# Altium schematic sheet OUTPUT.SchDoc: Titan Yuan
size Letter; DrawnBy: Titan Yuan; SheetNumber: 4; SheetTotal: 5
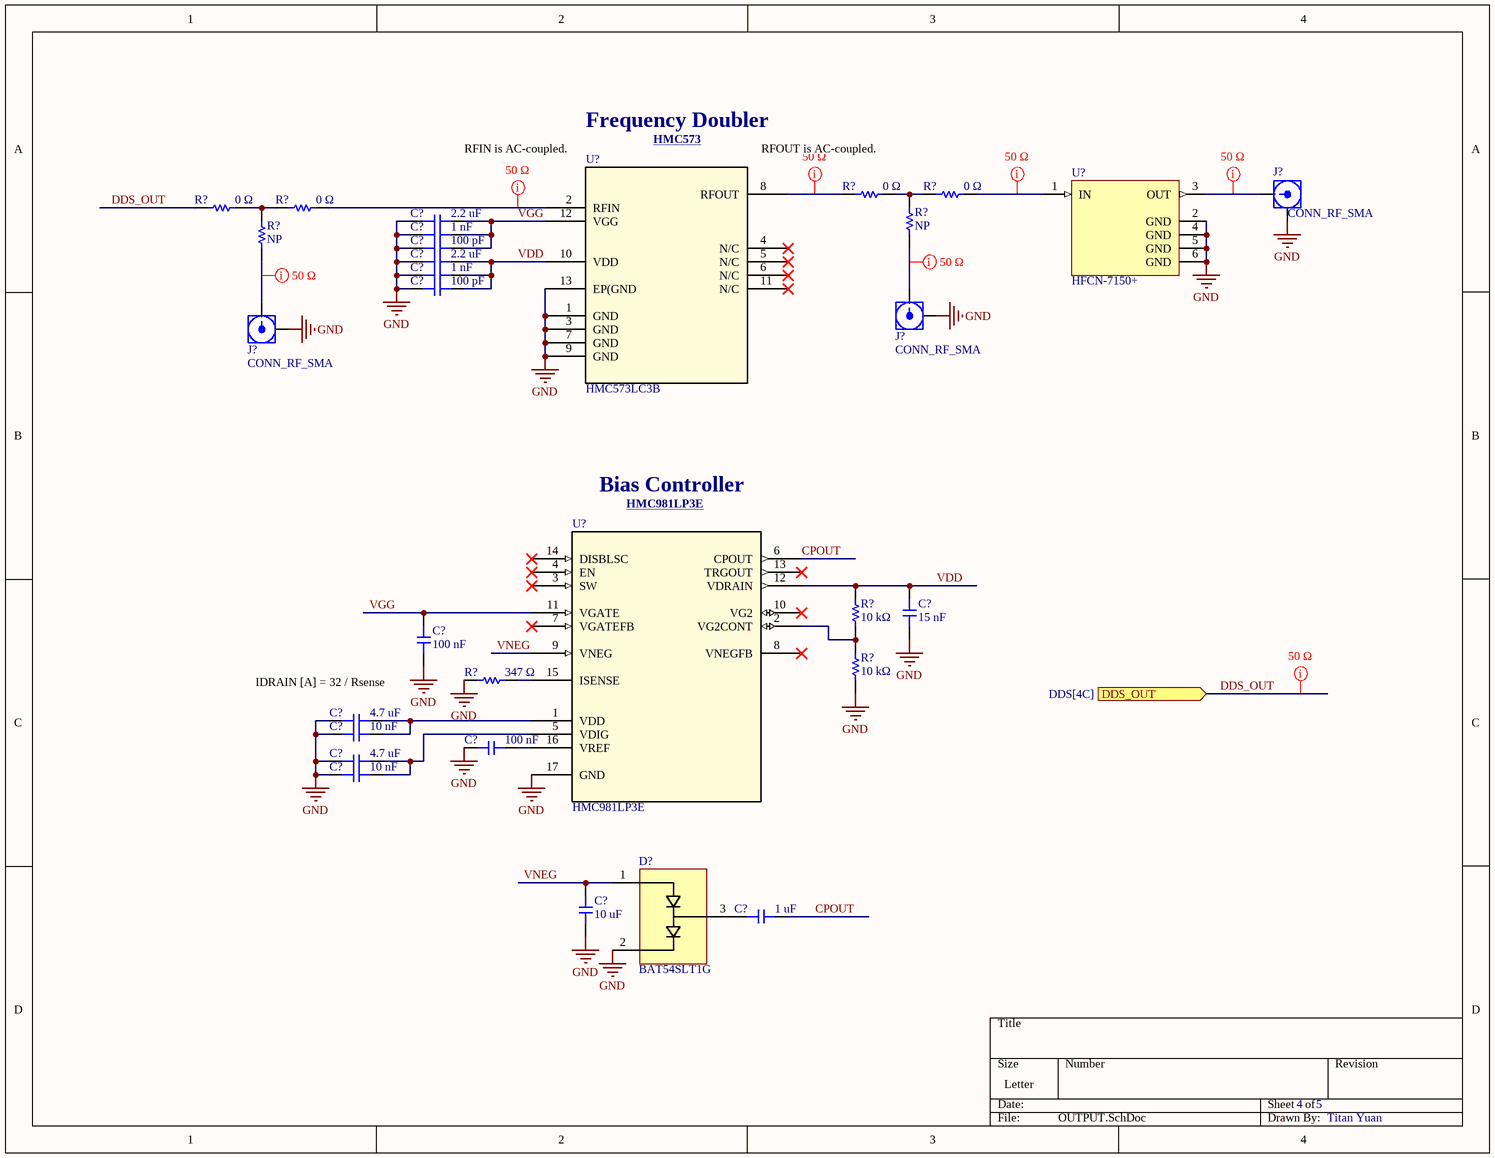
[diagram p0: OUTPUT.SchDoc]

## Parts
(Parts that share a designator on the sheet are numbered #1, #2 ... from top to bottom, then left to right.)
C?#1  2.2 uF  [CAP_0603]
C?#2  1 nF  [CAP_0402]
C?#3  100 pF  [CAP_0402]
C?#4  2.2 uF  [CAP_0603]
C?#5  1 nF  [CAP_0402]
C?#6  100 pF  [CAP_0402]
C?#7  15 nF  [CAP_0402]
C?#8  100 nF
C?#9  4.7 uF  [CAP_0603]
C?#10  10 nF  [CAP_0402]
C?#11  100 nF
C?#12  4.7 uF  [CAP_0603]
C?#13  10 nF  [CAP_0402]
C?#14  10 uF  [CAP_0805]
C?#15  1 uF  [CAP_0603]
D?  BAT54SLT1G  [BAT54SL]
J?#1  CONN_RF_SMA
J?#2  CONN_RF_SMA
J?#3  CONN_RF_SMA
R?#1  0 Ω  [RES_0402]
R?#2  0 Ω  [RES_0402]
R?#3  0 Ω  [RES_0402]
R?#4  0 Ω  [RES_0402]
R?#5  NP  [RES_0402]
R?#6  NP  [RES_0402]
R?#7  10 kΩ  [RES_0402]
R?#8  10 kΩ  [RES_0402]
R?#9  347 Ω  [RES_0603]
U?#1  HMC573LC3B  [HE_12_1_ADI]
U?#2  HFCN-7150+  [FV1206-1]
U?#3  HMC981LP3E  [QFN16_3X3_ADI]

## Ports
DDS_OUT (in, see DDS[4C])

## Nets
GND: C?#1.2 C?#2.2 C?#3.2 C?#4.2 C?#5.2 C?#6.2 C?#7.1 C?#8.1 C?#9.1 C?#10.1 C?#11.1 C?#12.1 C?#13.1 C?#14.1 D?.2 J?#1.2 J?#2.2 J?#3.2 R?#8.2 R?#9.1 U?#1.1(GND) U?#1.3(GND) U?#1.7(GND) U?#1.9(GND) U?#1.13(EP(GND) U?#2.2(GND) U?#2.4(GND) U?#2.5(GND) U?#2.6(GND) U?#3.17(GND)
CPOUT: C?#15.2 U?#3.6(CPOUT)
DDS_OUT: R?#3.1 ; port DDS_OUT
VDD: C?#4.1 C?#5.1 C?#6.1 C?#7.2 R?#7.1 U?#1.10(VDD) U?#3.12(VDRAIN)
VGG: C?#1.1 C?#2.1 C?#3.1 C?#8.2 U?#1.12(VGG) U?#3.11(VGATE)
VNEG: C?#14.2 D?.1 U?#3.9(VNEG)
NetC?#9_2: C?#9.2 C?#10.2 U?#3.1(VDD)
NetC?#11_2: C?#11.2 U?#3.16(VREF)
NetC?#12_2: C?#12.2 C?#13.2 U?#3.5(VDIG)
NetC?#15_1: C?#15.1 D?.3
NetJ?#1_1: J?#1.1 U?#2.3(OUT)
NetJ?#2_1: J?#2.1 R?#5.2
NetJ?#3_1: J?#3.1 R?#6.2
NetR?#1_1: R?#1.1 U?#1.8(RFOUT)
NetR?#1_2: R?#1.2 R?#2.1 R?#5.1
NetR?#2_2: R?#2.2 U?#2.1(IN)
NetR?#3_2: R?#3.2 R?#4.1 R?#6.1
NetR?#4_2: R?#4.2 U?#1.2(RFIN)
NetR?#7_2: R?#7.2 R?#8.1 U?#3.2(VG2CONT)
NetR?#9_2: R?#9.2 U?#3.15(ISENSE)

Not connected (* = marked no-connect by the designer): U?#1 4(N/C)* 5(N/C)* 6(N/C)* 11(N/C)*; U?#3 3(SW)* 4(EN)* 7(VGATEFB)* 8(VNEGFB)* 10(VG2)* 13(TRGOUT)* 14(DISBLSC)*

## Layout directives
net class 50 Ω: NetJ?#1_1, NetJ?#2_1, NetJ?#3_1, NetR?#1_1, NetR?#2_2, NetR?#4_2
mark named 50 Ω: DDS_OUT

## Notes on the sheet
- (near U?#1) RFIN is AC-coupled.
- Frequency Doubler
- (near U?#1) HMC573 <https://www.analog.com/en/products/hmc573.html>
- RFOUT is AC-coupled.
- Bias Controller
- (near U?#3) HMC981LP3E <https://www.analog.com/en/products/hmc981lp3e.html>
- (near C?#9) IDRAIN [A] = 32 / Rsense

## Library data of the parts
C?#1 C?#4 C?#9 C?#12 C?#15 = CAP: Capacitor SMD Generic; Voltage Rating: 0603; Manufacturer: *; Manufacturer Part Number: *; Tolerance: *; Dielectric: *; Package Size: *
C?#2 C?#3 C?#5-C?#8 C?#10 C?#11 C?#13 = CAP: Capacitor SMD Generic; Voltage Rating: 0402; Manufacturer: *; Manufacturer Part Number: *; Tolerance: *; Dielectric: *; Package Size: *
C?#14 = CAP: Capacitor SMD Generic; Voltage Rating: 0805; Manufacturer: *; Manufacturer Part Number: *; Tolerance: *; Dielectric: *; Package Size: *
D? = BAT54SLT1G: Diode Array 1 Pair Series Connection 30 V 200mA (DC) Surface Mount TO-236-3, SC-59, SOT-23-3; Manufacturer: onsemi; Manufacturer Part Number: BAT54SLT1G
J?#1-J?#3 = CONN_RF_SMA: Connector RF SMA Generic; Manufacturer: *; Manufacturer Part Number: *; Maximum Frequency: *
R?#1-R?#9 = RES: Resistor SMD Generic; Manufacturer: *; Manufacturer Part Number: *; Tolerance: *; Power Rating: *
  R?#1-R?#8: Package Size: 0402
  R?#9: Package Size: 0603
U?#1 = HMC573LC3B: x2 Active Multiplier SMT, 8 to 22 GHz Fout; Manufacturer_Name: Analog Devices Inc; Copyright: Copyright (C) 2026 Ultra Librarian. All rights reserved.; Manufacturer_Part_Number: HMC573LC3B; Datasheet: https://www.analog.com/media/en/technical-documentation/data-sheets/hmc573.pdf; RefDes: RefDes; Type: Type
U?#2 = HFCN-7150+: LTCC High Pass Filter, 7900 - 11000 MHz; Manufacturer: Mini-Circuits; Manufacturer Part Number: HFCN-7150+
U?#3 = HMC981LP3E: Active Bias Controller SMT; Manufacturer_Name: Analog Devices Inc; Copyright: Copyright (C) 2026 Ultra Librarian. All rights reserved.; Manufacturer_Part_Number: HMC981LP3E; Datasheet: https://www.analog.com/media/en/technical-documentation/data-sheets/hmc981.pdf; RefDes: RefDes; Type: Type